# Altium schematic sheet DCDC_stepup.SchDoc
size 381 x 304 mm
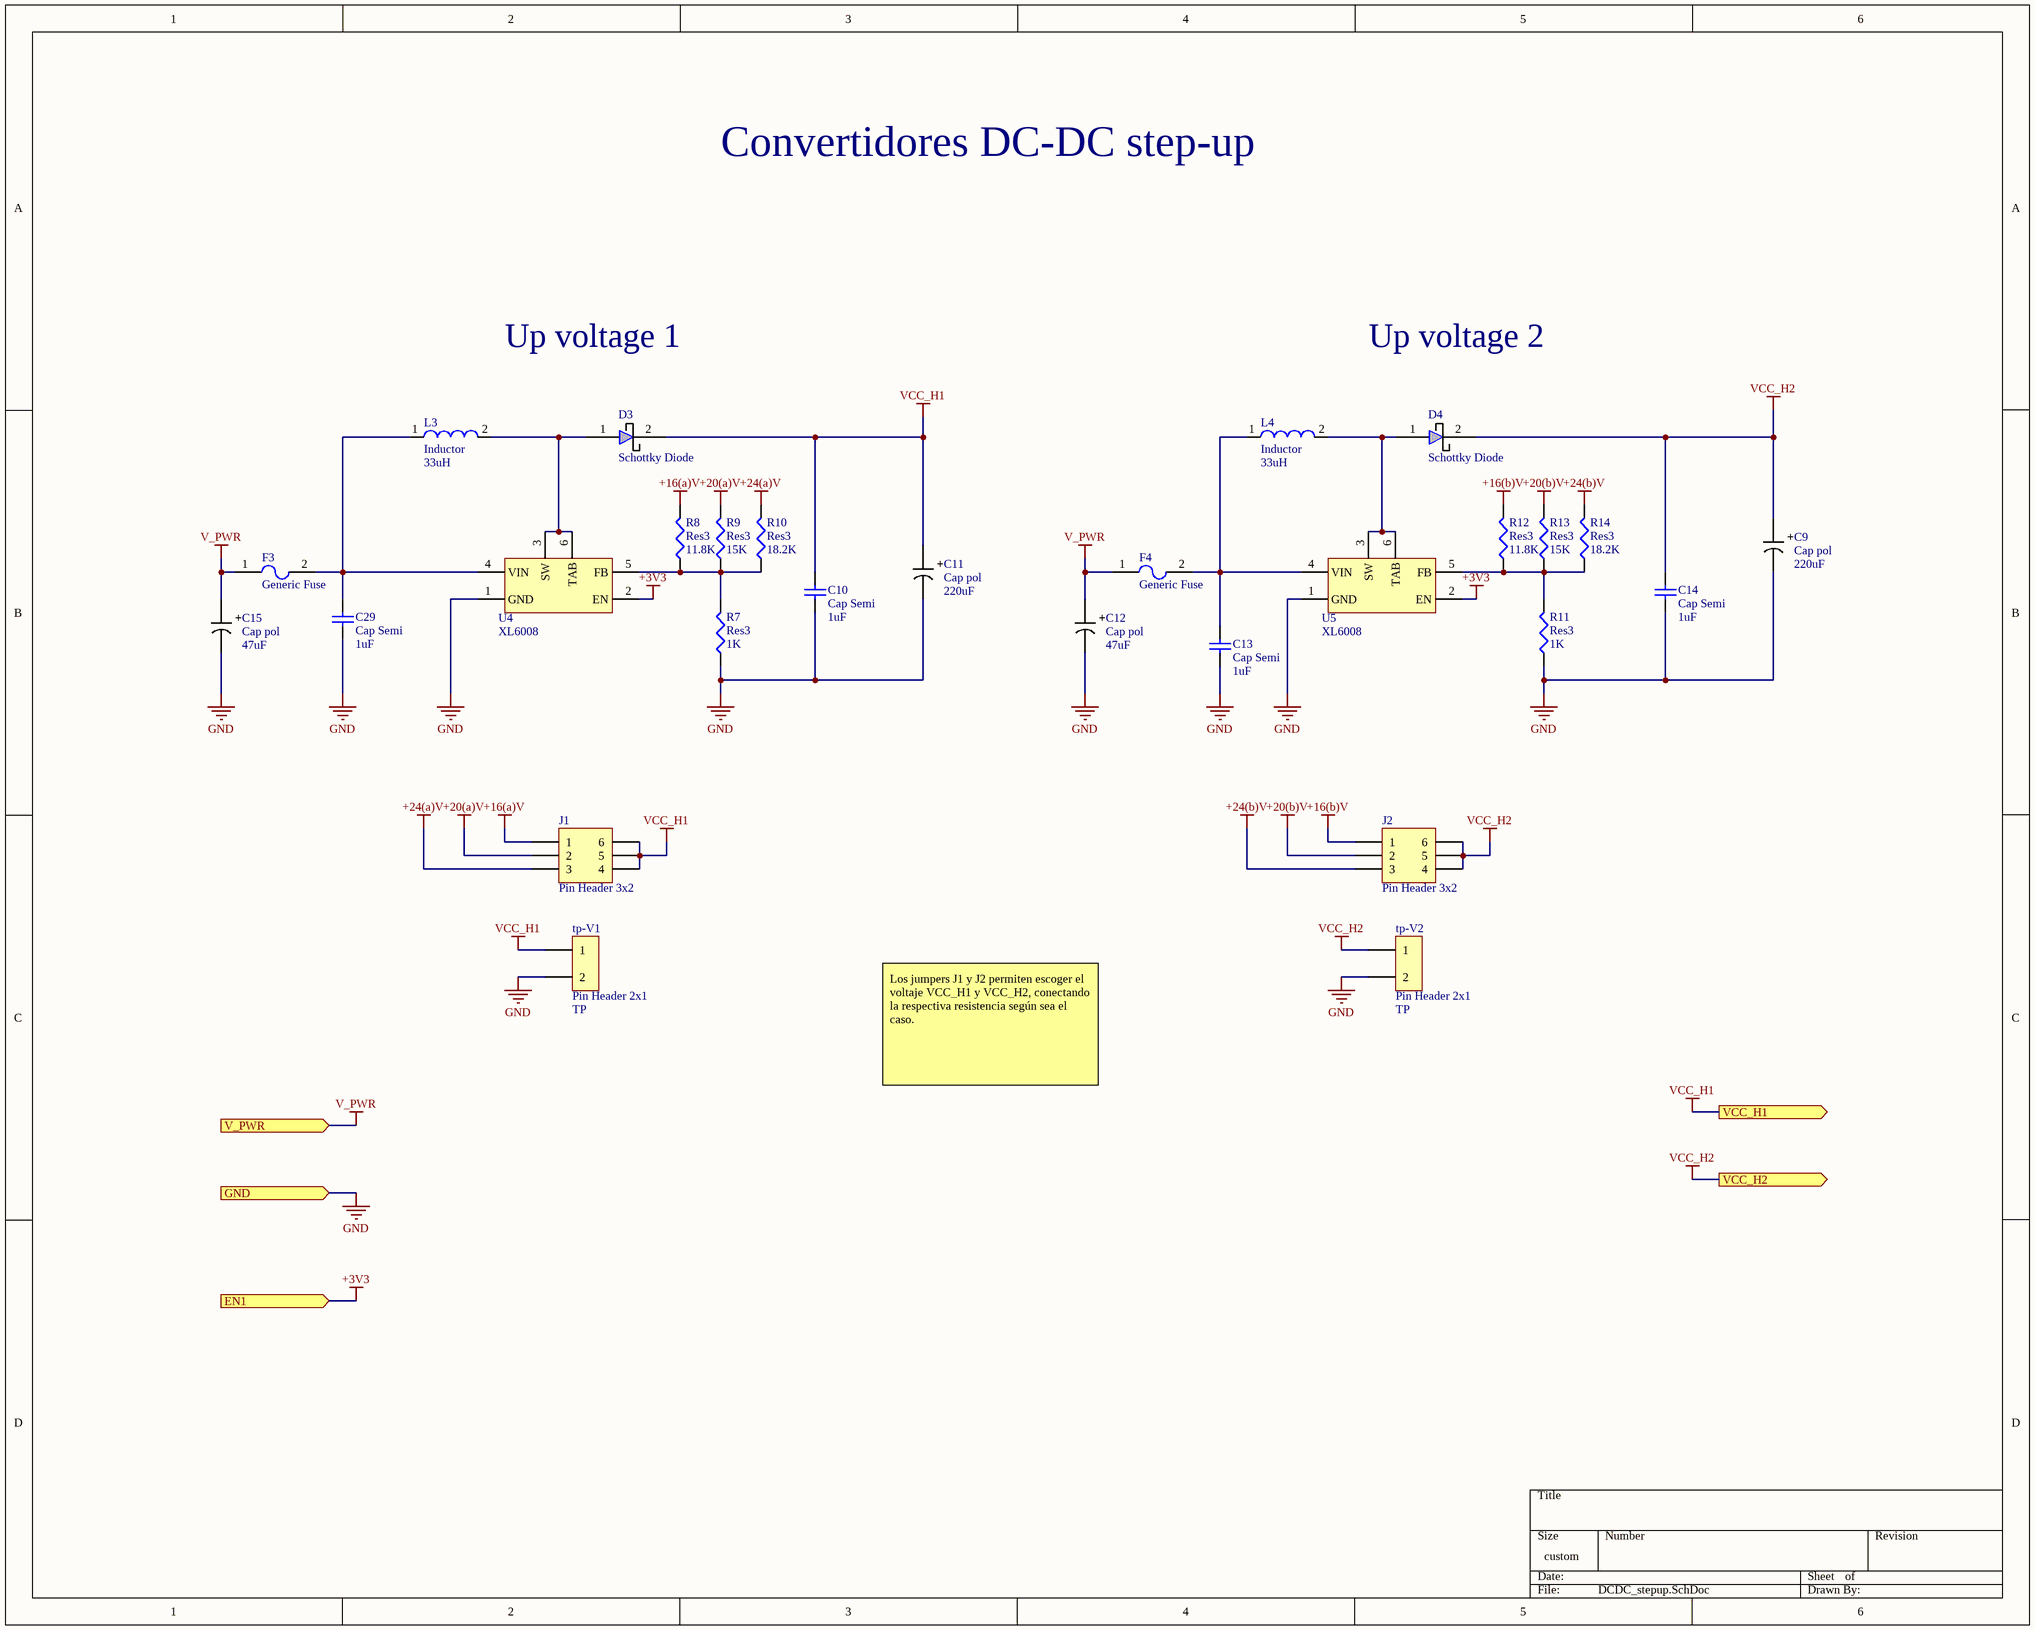
[diagram p0: DCDC_stepup.SchDoc]

## Parts
C9  Cap pol  value 220uF  [CAP_SMD_Electrolytic_10x10]
C10  Cap Semi  value 1uF  [1608[0603]]
C11  Cap pol  value 220uF  [CAP_SMD_Electrolytic_10x10]
C12  Cap pol  value 47uF  [CAP_SMD_Electrolytic_10x10]
C13  Cap Semi  value 1uF  [1608[0603]]
C14  Cap Semi  value 1uF  [1608[0603]]
C15  Cap pol  value 47uF  [CAP_SMD_Electrolytic_10x10]
C29  Cap Semi  value 1uF  [1608[0603]]
D3  Schottky Diode  [SMB_L4.6-W3.6-LS5.3-RD]
D4  Schottky Diode  [SMB_L4.6-W3.6-LS5.3-RD]
F3  Generic Fuse  [F1206]
F4  Generic Fuse  [F1206]
J1  Pin Header 3x2  [HDR-TH_6P-P2.54-V-R2-C3-S2.54_A2541WV-2X3P]
J2  Pin Header 3x2  [HDR-TH_6P-P2.54-V-R2-C3-S2.54_A2541WV-2X3P]
L3  Inductor  value 33uH  [IND-SMD_L12.3-W12.3]
L4  Inductor  value 33uH  [IND-SMD_L12.3-W12.3]
R7  Res3  value 1K  [J1-0603]
R8  Res3  value 11.8K  [J1-0603]
R9  Res3  value 15K  [J1-0603]
R10  Res3  value 18.2K  [J1-0603]
R11  Res3  value 1K  [J1-0603]
R12  Res3  value 11.8K  [J1-0603]
R13  Res3  value 15K  [J1-0603]
R14  Res3  value 18.2K  [J1-0603]
tp-V1  Pin Header 2x1  [HDR-TH_P2.54-H-M_A2541WV-2P]
tp-V2  Pin Header 2x1  [HDR-TH_P2.54-H-M_A2541WV-2P]
U4  XL6008  [TO-252-5]
U5  XL6008  [TO-252-5]

## Ports
EN1 (in), GND (in), V_PWR (in), VCC_H1 (out), VCC_H2 (out)

## Nets
+3V3: U4.2(EN) U5.2(EN) ; port EN1
+16(a)V: J1.1 R8.2
+16(b)V: J2.1 R12.2
+20(a)V: J1.2 R9.2
+20(b)V: J2.2 R13.2
+24(a)V: J1.3 R10.2
+24(b)V: J2.3 R14.2
GND: C9.1 C10.1 C11.1 C12.1 C13.1 C14.1 C15.1 C29.1 R7.1 R11.1 tp-V1.2 tp-V2.2 U4.1(GND) U5.1(GND) ; port GND
V_PWR: C12.2 C15.2 F3.1 F4.1 ; port V_PWR
VCC_H1: C10.2 C11.2 D3.2(-) J1.4 J1.5 J1.6 tp-V1.1 ; port VCC_H1
VCC_H2: C9.2 C14.2 D4.2(-) J2.4 J2.5 J2.6 tp-V2.1 ; port VCC_H2
NetC13_2: C13.2 F4.2 L4.1 U5.4(VIN)
NetC29_2: C29.2 F3.2 L3.1 U4.4(VIN)
NetD3_1: D3.1(+) L3.2 U4.3(SW) U4.6(TAB)
NetD4_1: D4.1(+) L4.2 U5.3(SW) U5.6(TAB)
NetR7_2: R7.2 R8.1 R9.1 R10.1 U4.5(FB)
NetR11_2: R11.2 R12.1 R13.1 R14.1 U5.5(FB)

## Notes on the sheet
- Convertidores DC-DC step-up
- Up voltage 1
- Up voltage 2
- (near tp-V1) TP
- (near tp-V2) TP
- Los jumpers J1 y J2 permiten escoger el voltaje VCC_H1 y VCC_H2, conectando la respectiva resistencia según sea el caso.
- (in symbol Cap pol) +

## Library data of the parts
C9 C11 = Cap pol: Electrolytic Aluminium Capacitor; Manufacturer: Lelon; Manufacturer Part Number: VE-221M1HTR-1010; Voltage: 50V; Supplier 1: LCSC; Supplier Part Number 1: C134732; Package: SMD,10x10mm
C10 C13 C14 C29 = Cap Semi: Capacitor (Semiconductor SIM Model); Manufacturer: Samsung Electro-Mechanics; Manufacturer Part Number: CL10A105KB8NNNC; Published: 8-Jun-2000; LatestRevisionDate: 29-May-2009; LatestRevisionNote: IPC-7351 Footprint Added.; PackageReference: C0603; Publisher: Altium Limited; PackageDescription: Chip Capacitor; Supplier 1: LCSC; Supplier Part Number 1: C15849
C12 C15 = Cap pol: Electrolytic Aluminium Capacitor; Manufacturer: Lelon; Manufacturer Part Number: VEJ470M1HTR-1010; Voltage: 50V; Supplier 1: LCSC; Supplier Part Number 1: C249662; Package: SMD,10x10mm
D3 D4 = Schottky Diode: Schottky Diodes; Manufacturer: MCC(Micro Commercial Components); Manufacturer Part Number: SK32B-LTP; Reverse voltage: 20V; Package: SMB; Supplier 1: LCSC; Supplier Part Number 1: C139945
F3 F4 = FUSE: SMD Fuse; Manufacturer: AEM; Manufacturer Part Number: F1206VH4500TM; Rated Voltage AC: 65V; Current Rating: 4.5A; Supplier 1: LCSC; Supplier Part Number 1: C310980; Package: 1206
J1 J2 = Header - 3x2c: Pin Header 6pos, 2 row, 2.54 pitch; Manufacturer: CJT(Changjiang Connectors); Manufacturer Part Number: A2541WV-2x3P; Pitch: 2.54; Supplier 1: LCSC; Supplier Part Number 1: C225518
L3 L4 = Inductor: Inductor SMD; Manufacturer: SXN(Shun Xiang Nuo Elec); Manufacturer Part Number: SMDRI127-330MT; Supplier 1: LCSC; Supplier Part Number 1: C9400; Package: SMD,12.3x12.3x8mm
R7 R11 = Res3: Resistor; Manufacturer: KAMAYA; Manufacturer Part Number: RMC16K102FTP; Published: 8-Jun-2000; LatestRevisionDate: 29-May-2009; LatestRevisionNote: IPC-7351 Footprint Added.; PackageReference: J1-0603; Publisher: Altium Limited; PackageDescription: Chip Resistor; Supplier 1: LCSC; Supplier Part Number 1: C323557
R8 R12 = Res3: Resistor; Manufacturer Part Number: AC0603FR-0711K8L; Manufacturer: YAGEO; Published: 8-Jun-2000; LatestRevisionDate: 29-May-2009; LatestRevisionNote: IPC-7351 Footprint Added.; PackageReference: J1-0603; Publisher: Altium Limited; PackageDescription: Chip Resistor; Supplier 1: LCSC; Supplier Part Number 1: C227561
R9 R13 = Res3: Resistor; Manufacturer: YAGEO; Manufacturer Part Number: RC0603FR-0715KL; Published: 8-Jun-2000; LatestRevisionDate: 29-May-2009; LatestRevisionNote: IPC-7351 Footprint Added.; PackageReference: J1-0603; Publisher: Altium Limited; PackageDescription: Chip Resistor; Supplier 1: LCSC; Supplier Part Number 1: C114661
R10 R14 = Res3: Resistor; Manufacturer: RALEC; Manufacturer Part Number: RTT031822FTP; Published: 8-Jun-2000; LatestRevisionDate: 29-May-2009; LatestRevisionNote: IPC-7351 Footprint Added.; PackageReference: J1-0603; Publisher: Altium Limited; PackageDescription: Chip Resistor; Supplier 1: LCSC; Supplier Part Number 1: C103358
tp-V1 tp-V2 = Header - 2x1c: Pin Header 2pos, 1 row, 2.54 pitch; Manufacturer: CJT(Changjiang Connectors); Manufacturer Part Number: A2541WV-2P; Pitch: 2.54; Supplier 1: LCSC; Supplier Part Number 1: C225477
U4 U5 = XL6008: DC-DC Converters Step-Up, Step-Up/Step-Down Adjustable 1 3.6V 32V 3A TO-252-5 RoHS; Manufacturer: XLSEMI; Manufacturer Part Number: XL6008E1; Package: TO-252-5; Supplier 1: LCSC; Supplier Part Number 1: C73012